# Altium schematic sheet Main.SchDoc
size A4
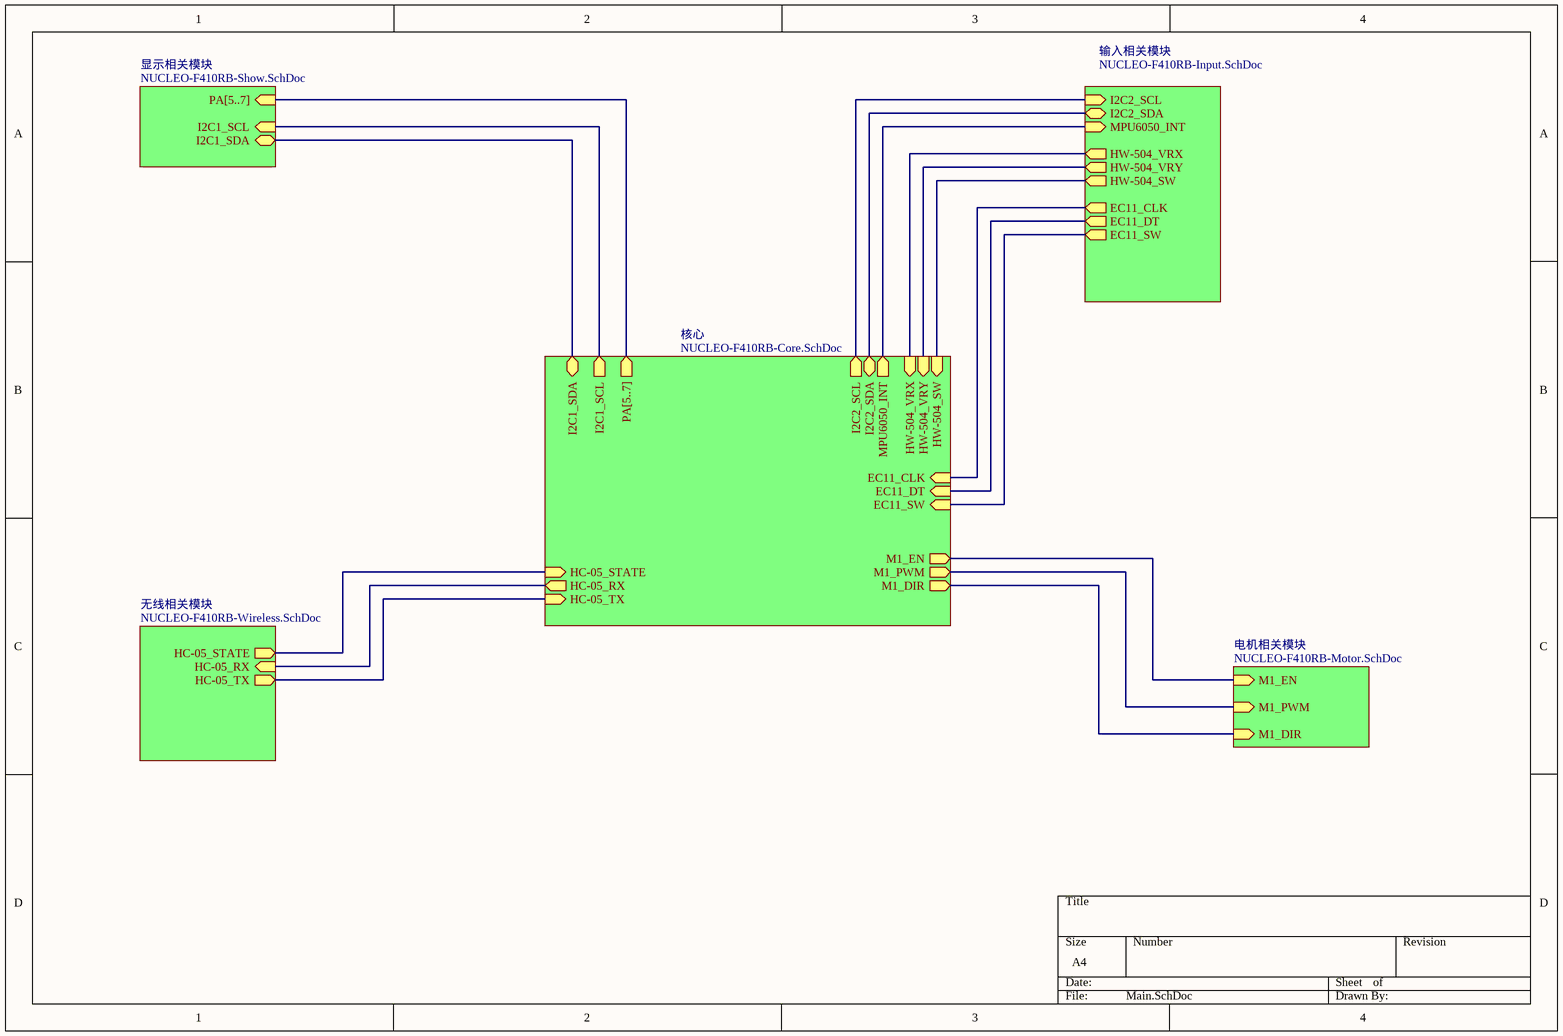
[diagram p0: Main.SchDoc]

## Sub-sheets
无线相关模块 = NUCLEO-F410RB-Wireless.SchDoc: HC-05_STATE (out), HC-05_RX (in), HC-05_TX (out)
显示相关模块 = NUCLEO-F410RB-Show.SchDoc: PA[5..7] (in), I2C1_SCL (in), I2C1_SDA (bidir)
核心 = NUCLEO-F410RB-Core.SchDoc: M1_EN (out), M1_PWM (out), M1_DIR (out), PA[5..7] (out), I2C1_SCL (out), I2C1_SDA (bidir), I2C2_SCL (out), I2C2_SDA (bidir), MPU6050_INT (out), HW-504_VRX (in), HW-504_VRY (in), HW-504_SW (in), EC11_CLK (in), EC11_DT (in), EC11_SW (in), HC-05_STATE (in), HC-05_RX (out), HC-05_TX (in)
电机相关模块 = NUCLEO-F410RB-Motor.SchDoc: M1_EN (in), M1_PWM (in), M1_DIR (in)
输入相关模块 = NUCLEO-F410RB-Input.SchDoc: I2C2_SCL (in), I2C2_SDA (bidir), MPU6050_INT (in), HW-504_VRX (out), HW-504_VRY (out), HW-504_SW (out), EC11_CLK (out), EC11_DT (out), EC11_SW (out)

## Nets
(unnamed): sheet 核心/M1_EN, sheet 电机相关模块/M1_EN
(unnamed): sheet 核心/M1_PWM, sheet 电机相关模块/M1_PWM
(unnamed): sheet 核心/M1_DIR, sheet 电机相关模块/M1_DIR
(unnamed): sheet 核心/I2C1_SCL, sheet 显示相关模块/I2C1_SCL
(unnamed): sheet 核心/I2C1_SDA, sheet 显示相关模块/I2C1_SDA
(unnamed): sheet 核心/I2C2_SCL, sheet 输入相关模块/I2C2_SCL
(unnamed): sheet 核心/I2C2_SDA, sheet 输入相关模块/I2C2_SDA
(unnamed): sheet 核心/MPU6050_INT, sheet 输入相关模块/MPU6050_INT
(unnamed): sheet 核心/HW-504_VRX, sheet 输入相关模块/HW-504_VRX
(unnamed): sheet 核心/HW-504_VRY, sheet 输入相关模块/HW-504_VRY
(unnamed): sheet 核心/HW-504_SW, sheet 输入相关模块/HW-504_SW
(unnamed): sheet 核心/EC11_CLK, sheet 输入相关模块/EC11_CLK
(unnamed): sheet 核心/EC11_DT, sheet 输入相关模块/EC11_DT
(unnamed): sheet 核心/EC11_SW, sheet 输入相关模块/EC11_SW
(unnamed): sheet 核心/HC-05_STATE, sheet 无线相关模块/HC-05_STATE
(unnamed): sheet 核心/HC-05_RX, sheet 无线相关模块/HC-05_RX
(unnamed): sheet 核心/HC-05_TX, sheet 无线相关模块/HC-05_TX

## Buses and harness runs
bus sheet 显示相关模块/PA[5..7] = sheet 核心/PA[5..7]